# Altium schematic sheet Guitar Amp_0.SchDoc
size 100 x 83 mm
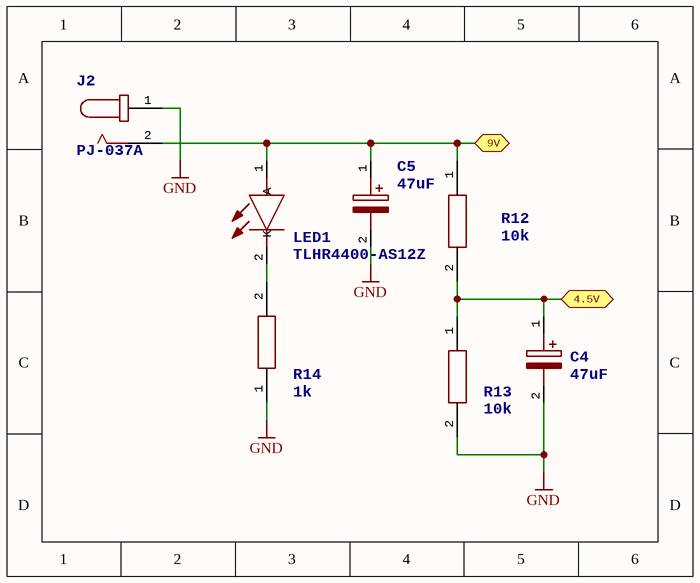
[diagram p0: Guitar Amp_0.SchDoc]

## Parts
C4  47uF  [CAPPRD200W55D500H1200]
C5  47uF  [CAPPRD200W55D500H1200]
J2  PJ-037A  [CUI_PJ-037A]
LED1  TLHR4400-AS12Z  [TLHR4400AS12Z]
R12  10k  [RESAD1630W60L710D230]
R13  10k  [RESAD1630W60L710D230]
R14  1k  [RESAD1630W60L710D230]

## Ports
4.5V, 9V

## Nets
GND: C4.2(-) C5.2(-) J2.1 R13.2 R14.1
4.5V: C4.1(+) R12.2 R13.1 ; port 4.5V
9V: C5.1(+) J2.2 LED1.1(A) R12.1 ; port 9V
NetLED1_2: LED1.2(K) R14.2

## Library data of the parts
C4 C5 = ECA-1CM470: Panasonic Aluminium Electrolytic Capacitor 47uF 16V dc 5mm M Series Aluminium, Through Hole Electrolytic, +/-20%   Source:  Datasheet
J2 = PJ-037A: 2.0 mm Center Pin, 2.5 A, Right Angle, Through Hole, Dc Power Jack Connector Buy Part
LED1 = TLHR4400-AS12Z: Standard LEDs - Through Hole Red 13mcd; 3mm 612-625nm; 2V Typ   Source:  Datasheet
R12-R14 = MF1_4LCT52R103J: Metal Film Resistors - Through Hole 1/4 WATT 10K OHM 5%   Source:  Datasheet